# Altium schematic sheet proximity_kt.SchDoc
size A1
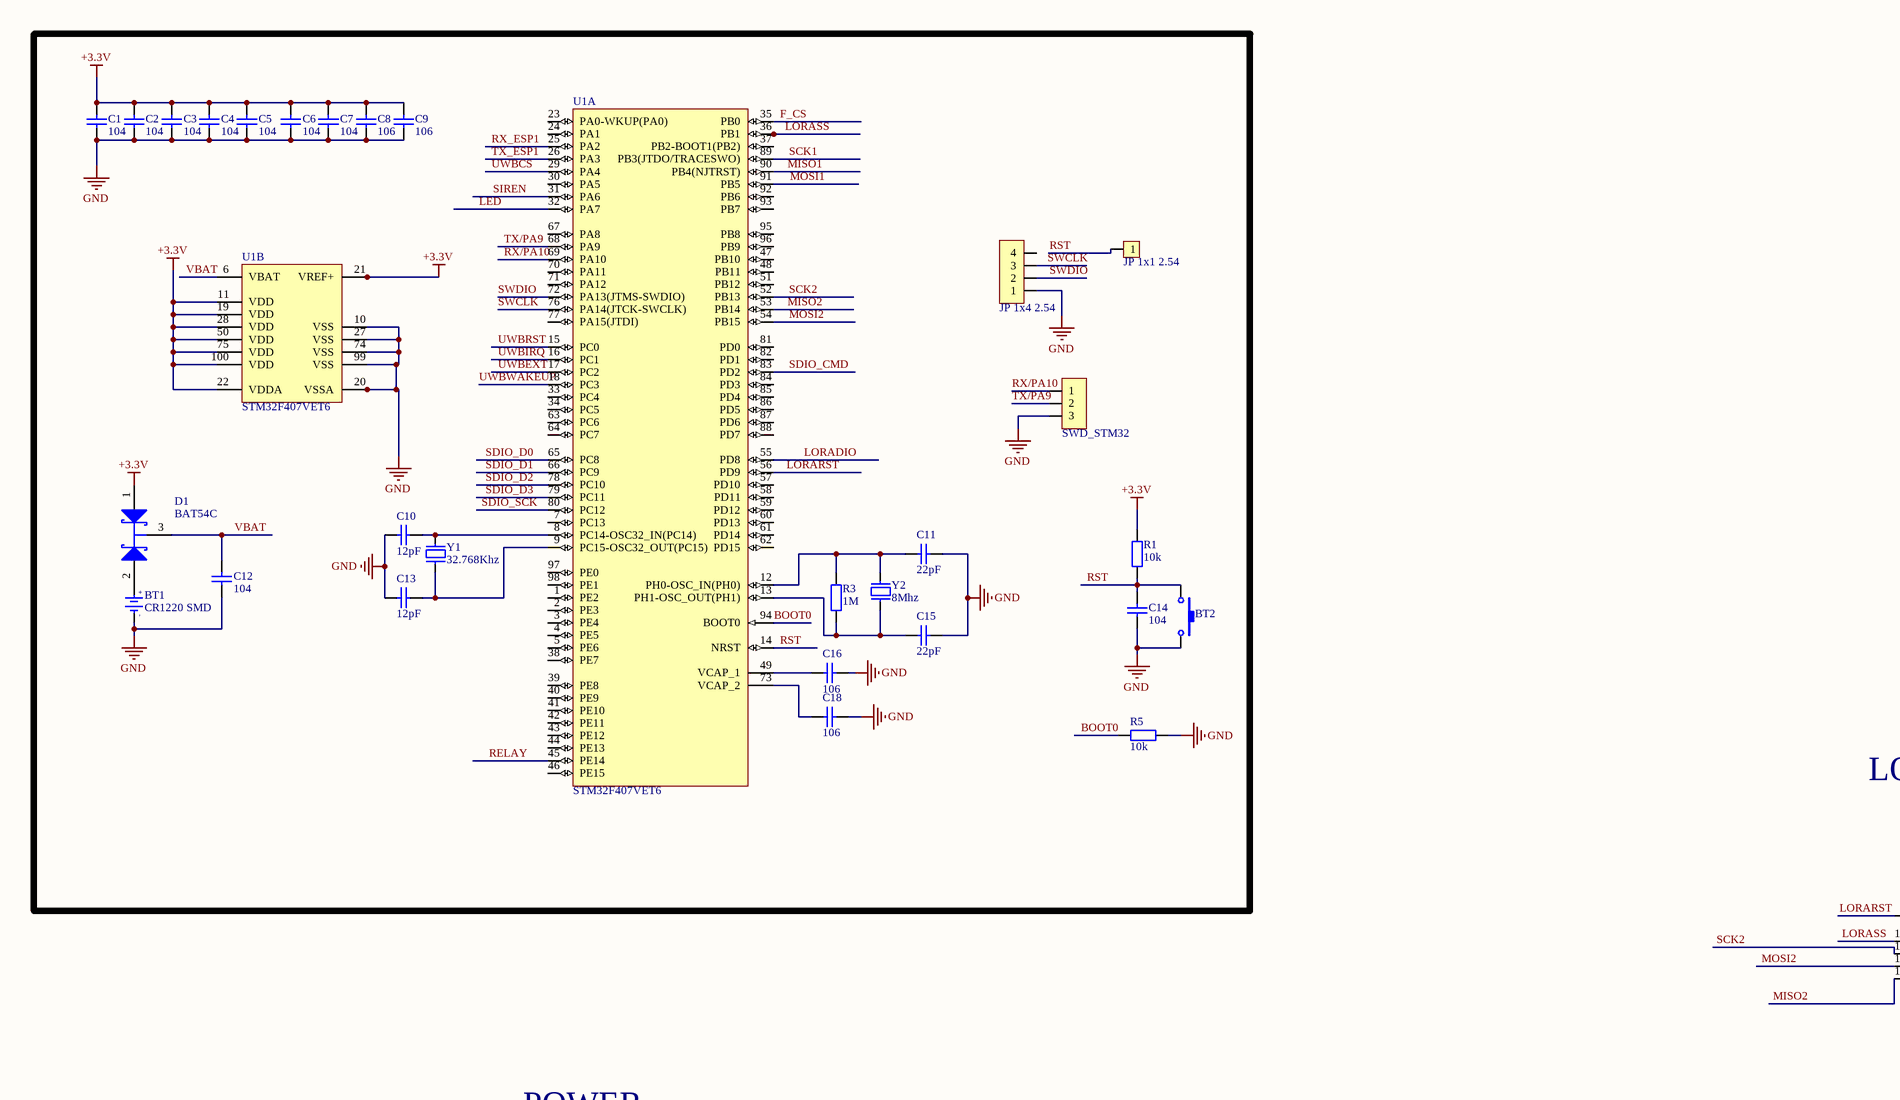
[diagram p0: proximity_kt.SchDoc, top left]
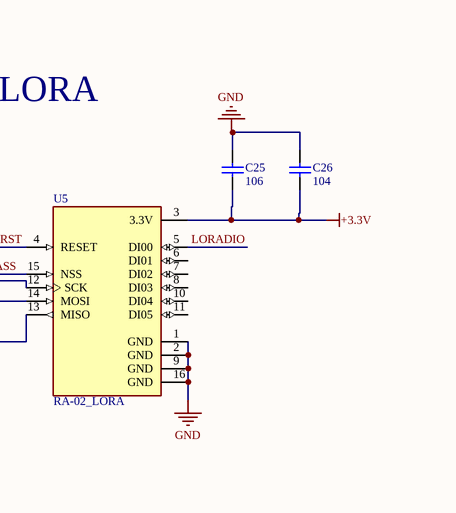
[diagram p1: proximity_kt.SchDoc, top right]
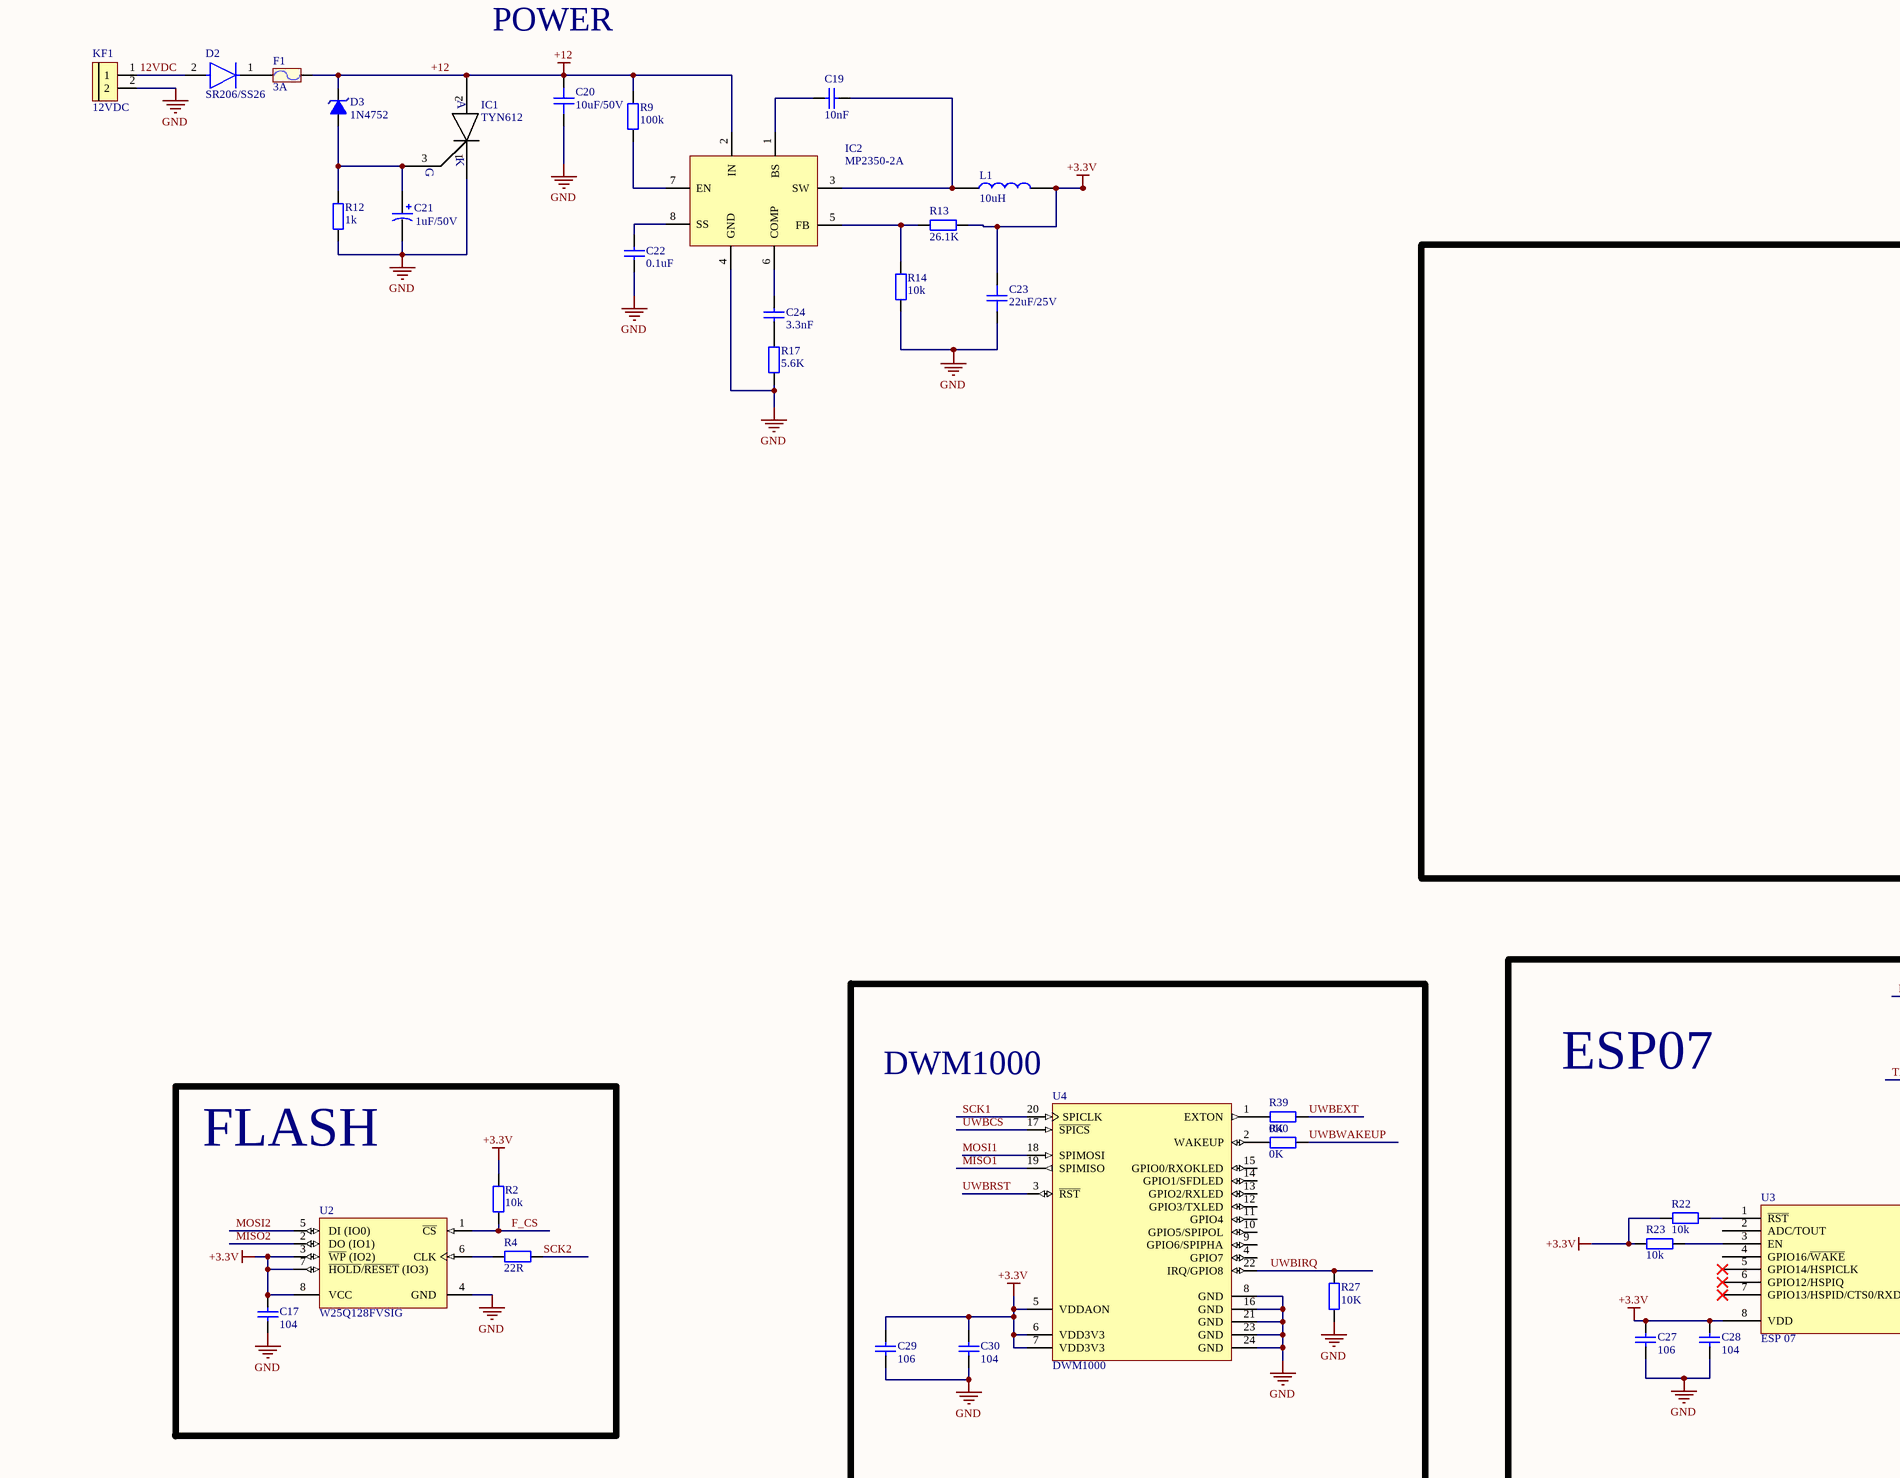
[diagram p2: proximity_kt.SchDoc, bottom left]
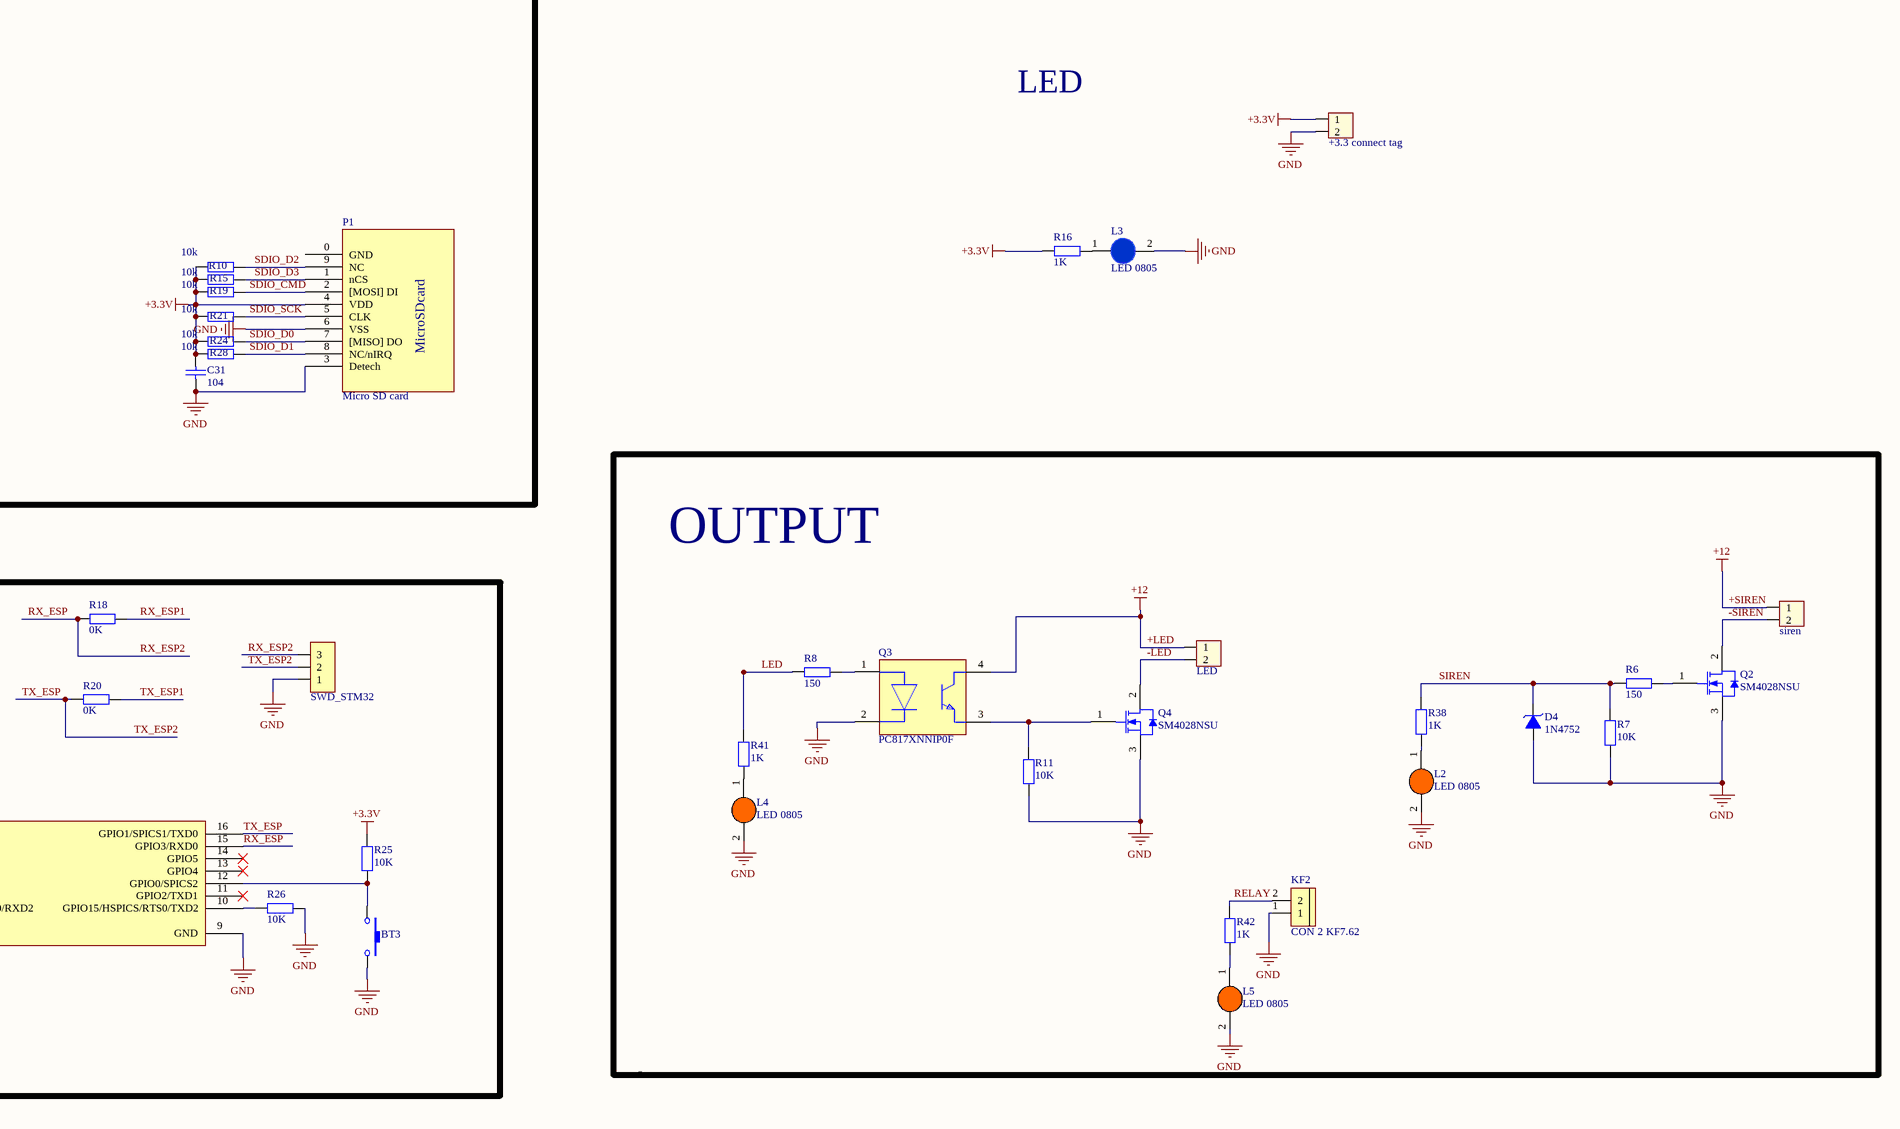
[diagram p3: proximity_kt.SchDoc, bottom right]

## Parts
BT1  CR1220 SMD  [DE PIN CR1220]
BT2  Nut Nhan 2 Chan SMD 3x6x2.5  [Nut Nhan 2 Chan SMD 3x6x2.5]  (value not drawn)
BT3  Nut Nhan 2 Chan SMD 3x6x2.5  [Nut Nhan 2 Chan SMD 3x6x2.5]  (value not drawn)
C1  104  [tu 0805]
C2  104  [tu 0805]
C3  104  [tu 0805]
C4  104  [tu 0805]
C5  104  [tu 0805]
C6  104  [tu 0805]
C7  104  [tu 0805]
C8  106  [tu 0805]
C9  106  [tu 0805]
C10  12pF  [tu 0805]
C11  22pF  [tu 0805]
C12  104  [tu 0805]
C13  12pF  [tu 0805]
C14  104  [tu 0805]
C15  22pF  [tu 0805]
C16  106  [tu 0805]
C17  104  [tu 0805]
C18  106  [tu 0805]
C19  10nF  [tu 0805]
C20  10uF/50V  [CAPC-1210 (3225)]
C21  1uF/50V  [CAP_ALUM_SMD_4054_TYPE_B]
C22  0.1uF  [tu 0805]
C23  22uF/25V  [CAPC-1210 (3225)]
C24  3.3nF  [tu 0805]
C25  106  [tu 0805]
C26  104  [tu 0805]
C27  106  [tu 0805]
C28  104  [tu 0805]
C29  106  [tu 0805]
C30  104  [tu 0805]
C31  104  [tu 0805]
D1  BAT54C  [NXP-SOT23-3_V]
D2  SR206/SS26  [FP-95401-MFG]
D3  1N4752  [DIODE ZENNER SMD SOD80]
D4  1N4752  [DIODE ZENNER SMD SOD80]
F1  3A  [Cau Chi SMD1808]
H2  siren  [XH2.54M-2]
H3  +3.3 connect tag  [XH2.54M-2]
H5  LED  [XH2.54M-2]
IC1  TYN612  [TYN612VER1]
IC2  MP2350-2A  [MP2305]
JP1  JP 1x4 2.54  [JP 1x4 DT]
JP2  SWD_STM32  [JP 1x3 DT]
JP3  SWD_STM32  [JP 1x3 DT]
JP5  JP 1x1 2.54  [JP 1x1 DT]
KF1  12VDC  [Con 2 KF301 5.08]
KF2  CON 2 KF7.62  [CON 2 KF7.62]
L1  10uH  [Cuon Cam 7x7x5]
L2  LED 0805  [LED-0805-Orange]
L3  LED 0805  [LED-0805-Blue]
L4  LED 0805  [LED-0805-Orange]
L5  LED 0805  [LED-0805-Orange]
P1  Micro SD card  [MicroSD]
Q2  SM4028NSU  [INF-PG-TO252-3-313_L]
Q3  PC817XNNIP0F  [FP-PC817XNNIP0F-MFG]
Q4  SM4028NSU  [INF-PG-TO252-3-313_L]
R1  10k  [tro smd 0805]
R2  10k  [tro smd 0805]
R3  1M  [tro smd 0805]
R4  22R  [tro smd 0805]
R5  10k  [tro smd 0805]
R6  150  [tro smd 0805]
R7  10K  [tro smd 0805]
R8  150  [tro smd 0805]
R9  100k  [tro smd 0805]
R10  10k  [tro smd 0805]
R11  10K  [tro smd 0805]
R12  1k  [tro smd 0805]
R13  26.1K  [tro smd 0805]
R14  10k  [tro smd 0805]
R15  10k  [tro smd 0805]
R16  1K  [tro smd 0805]
R17  5.6K  [tro smd 0805]
R18  0K  [tro smd 0805]
R19  10k  [tro smd 0805]
R20  0K  [tro smd 0805]
R21  10k  [tro smd 0805]
R22  10k  [tro smd 0805]
R23  10k  [tro smd 0805]
R24  10k  [tro smd 0805]
R25  10K  [tro smd 0805]
R26  10K  [tro smd 0805]
R27  10K  [tro smd 0805]
R28  10k  [tro smd 0805]
R38  1K  [tro smd 0805]
R39  0K  [tro smd 0805]
R40  0K  [tro smd 0805]
R41  1K  [tro smd 0805]
R42  1K  [tro smd 0805]
U1  STM32F407VET6  [STM-LQFP100_M]  (parts A,B of 2)
U2  W25Q128FVSIG  [WINB-SOIC-8_M]
U3  ESP 07  [ESP8266 07]
U4  DWM1000  [DECW-DWM1000-24_V]
U5  RA-02_LORA  [MODULE_RA-02_LORA]
Y1  32.768Khz  [Thach Anh 2 Chan 32,768 KHz]
Y2  8Mhz  [Thach Anh 2 chan SMD]

## Blocks framed on the sheet
OUTPUT: D4 H2 H5 KF2 L2 L4 L5 Q2-Q4 R6-R8 R11 R38 R41 R42
DWM1000: C29 C30 R27 R39 R40 U4
ESP07: BT3 C27 C28 JP2 R18 R20 R22 R23 R25 R26 U3
FLASH: C17 R2 R4 U2

## Nets
+3.3V: C1.1 C2.1 C3.1 C4.1 C5.1 C6.1 C7.1 C8.1 C9.1 C17.1 C23.2 C25.2 C26.2 C27.1 C28.1 C29.1 C30.1 C31.1 D1.1(A) H3.1 L1.2 P1.4(VDD) R1.2 R2.2 R10.2 R13.2 R15.2 R16.2 R19.2 R21.2 R22.2 R23.2 R24.2 R25.2 R28.2 U1.11(VDD) U1.19(VDD) U1.21(VREF+) U1.22(VDDA) U1.28(VDD) U1.50(VDD) U1.75(VDD) U1.100(VDD) U2.3(~{WP}_(IO2)) U2.7(~{HOLD}/~{RESET}_(IO3)) U2.8(VCC) U3.8(VDD) U4.5(VDDAON) U4.6(VDD3V3) U4.7(VDD3V3) U5.3(3.3V)
+12: C20.2 D3.2(K) F1.2 H2.1 H5.1 IC1.2(A) IC2.2(IN) Q3.4(C) R9.1  [also labelled +LED, +SIREN]
GND: BT1.2(GND) BT2.2 BT3.2 C1.2 C2.2 C3.2 C4.2 C5.2 C6.2 C7.2 C8.2 C9.2 C10.2 C11.1 C12.2 C13.2 C14.2 C15.1 C16.1 C17.2 C18.1 C20.1 C21.2 C22.2 C23.1 C25.1 C26.1 C27.2 C28.2 C29.2 C30.2 C31.2 D4.1(A) H3.2 IC1.1(K) IC2.4(GND) JP1.1 JP2.1 JP3.3 KF1.2 KF2.1 L2.2(K) L3.2(K) L4.2(K) L5.2(K) P1.3(Detech) P1.6(VSS) Q2.3(SOURCE) Q3.2(C) Q4.3(SOURCE) R5.1 R7.2 R11.2 R12.1 R14.2 R17.2 R26.2 R27.1 U1.10(VSS) U1.20(VSSA) U1.27(VSS) U1.74(VSS) U1.99(VSS) U2.4(GND) U3.9(GND) U4.8(GND) U4.16(GND) U4.21(GND) U4.23(GND) U4.24(GND) U5.1(GND) U5.2(GND) U5.9(GND) U5.16(GND)
12VDC: D2.2(A) KF1.1
-LED: H5.2 Q4.2(DRAIN)
-SIREN: H2.2 Q2.2(DRAIN)
BOOT0: R5.2 U1.94(BOOT0)
F_CS: R2.1 U1.35(PB0) U2.1(~{CS})
LED: R8.2 R41.2 U1.32(PA7)
LORADIO: U1.55(PD8) U5.5(DI00)
LORARST: U1.56(PD9) U5.4(RESET)
LORASS: U1.36(PB1) U5.15(NSS)
MISO1: U1.90(PB4(NJTRST)) U4.19(SPIMISO)
MISO2: U1.53(PB14) U2.2(DO_(IO1)) U5.13(MISO)
MOSI1: U1.91(PB5) U4.18(SPIMOSI)
MOSI2: U1.54(PB15) U2.5(DI_(IO0)) U5.14(MOSI)
RELAY: KF2.2 R42.2 U1.45(PE14)
RST: BT2.1 C14.1 JP5.1 R1.1 U1.14(NRST)
RX/PA10: JP3.1 U1.69(PA10)
RX_ESP: JP2.3 R18.1 U3.15(GPIO3/RXD0)  [also labelled RX_ESP2]
RX_ESP1: R18.2 U1.25(PA2)
SCK1: U1.89(PB3(JTDO/TRACESWO)) U4.20(SPICLK)
SCK2: R4.2 U1.52(PB13) U5.12(SCK)
SDIO_CMD: P1.2([MOSI]_DI) R19.1 U1.83(PD2)
SDIO_D0: P1.7([MISO]_DO) R24.1 U1.65(PC8)
SDIO_D1: P1.8(NC/nIRQ) R28.1 U1.66(PC9)
SDIO_D2: P1.9(NC) R10.1 U1.78(PC10)
SDIO_D3: P1.1(nCS) R15.1 U1.79(PC11)
SDIO_SCK: P1.5(CLK) R21.1 U1.80(PC12)
SIREN: D4.2(K) R6.2 R7.1 R38.2 U1.31(PA6)
SWCLK: JP1.3 U1.76(PA14(JTCK-SWCLK))
SWDIO: JP1.2 U1.72(PA13(JTMS-SWDIO))
TX/PA9: JP3.2 U1.68(PA9)
TX_ESP: JP2.2 R20.1 U3.16(GPIO1/SPICS1/TXD0)  [also labelled TX_ESP2]
TX_ESP1: R20.2 U1.26(PA3)
UWBCS: U1.29(PA4) U4.17(~{SPICS})
UWBEXT: R39.2 U1.17(PC2)
UWBIRQ: R27.2 U1.16(PC1) U4.22(IRQ/GPIO8)
UWBRST: U1.15(PC0) U4.3(~{RST})
UWBWAKEUP: R40.2 U1.18(PC3)
VBAT: C12.1 D1.3(K) U1.6(VBAT)
NetBT1_1: BT1.1(+3V) D1.2(A)
NetBT3_1: BT3.1 R25.1 U3.12(GPIO0/SPICS2)
NetC10_1: C10.1 U1.8(PC14-OSC32_IN(PC14)) Y1.2
NetC11_2: C11.2 R3.2 U1.12(PH0-OSC_IN(PH0)) Y2.2
NetC13_1: C13.1 U1.9(PC15-OSC32_OUT(PC15)) Y1.1
NetC15_2: C15.2 R3.1 U1.13(PH1-OSC_OUT(PH1)) Y2.1
NetC16_2: C16.2 U1.49(VCAP_1)
NetC18_2: C18.2 U1.73(VCAP_2)
NetC19_1: C19.1 IC2.1(BS)
NetC19_2: C19.2 IC2.3(SW) L1.1
NetC21_1: C21.1 D3.1(A) IC1.3(G) R12.2
NetC22_1: C22.1 IC2.8(SS)
NetC24_1: C24.1 IC2.6(COMP)
NetC24_2: C24.2 R17.1
NetD2_1: D2.1(C) F1.1
NetIC2_5: IC2.5(FB) R13.1 R14.1
NetIC2_7: IC2.7(EN) R9.2
NetL2_1: L2.1(A) R38.1
NetL3_1: L3.1(A) R16.1
NetL4_1: L4.1(A) R41.1
NetL5_1: L5.1(A) R42.1
NetQ2_1: Q2.1(GATE) R6.1
NetQ3_1: Q3.1(A) R8.1
NetQ3_3: Q3.3(E) Q4.1(GATE) R11.1
NetR4_1: R4.1 U2.6(CLK)
NetR22_1: R22.1 U3.1(~{RST})
NetR23_1: R23.1 U3.3(EN)
NetR26_1: R26.1 U3.10(GPIO15/HSPICS/RTS0/TXD2)
NetR39_1: R39.1 U4.1(EXTON)
NetR40_1: R40.1 U4.2(WAKEUP)

Not connected (* = marked no-connect by the designer): JP1 4; P1 0(GND); U1 1(PE2) 2(PE3) 3(PE4) 4(PE5) 5(PE6) 7(PC13) 23(PA0-WKUP(PA0)) 24(PA1) 30(PA5) 33(PC4) 34(PC5) 37(PB2-BOOT1(PB2)) 38(PE7) 39(PE8) 40(PE9) 41(PE10) 42(PE11) 43(PE12) 44(PE13) 46(PE15) 47(PB10) 48(PB11) 51(PB12) 57(PD10) 58(PD11) 59(PD12) 60(PD13) 61(PD14) 62(PD15) 63(PC6) 64(PC7) 67(PA8) 70(PA11) 71(PA12) 77(PA15(JTDI)) 81(PD0) 82(PD1) 84(PD3) 85(PD4) 86(PD5) 87(PD6) 88(PD7) 92(PB6) 93(PB7) 95(PB8) 96(PB9) 97(PE0) 98(PE1); U3 2(ADC/TOUT) 4(GPIO16/~{WAKE}) 5(GPIO14/HSPICLK)* 6(GPIO12/HSPIQ)* 7(GPIO13/HSPID/CTS0/RXD2)* 11(GPIO2/TXD1)* 13(GPIO4)* 14(GPIO5)*; U4 4(GPIO7) 9(GPIO6/SPIPHA) 10(GPIO5/SPIPOL) 11(GPIO4) 12(GPIO3/TXLED) 13(GPIO2/RXLED) 14(GPIO1/SFDLED) 15(GPIO0/RXOKLED); U5 6(DI01) 7(DI02) 8(DI03) 10(DI04) 11(DI05)

## Notes on the sheet
- LORA
- (near C20) POWER
- LED
- (in symbol De pin CR1220 SMD) +; -
- (in symbol Micro SD card) MicroSDcard

## Library data of the parts
BT1 = De pin CR1220 SMD: Ten: Đế PIN CR1220 SMD; Ma_Hang: MH000833; ComponentLink1Description: New link; ComponentLink1URL: https://www.thegioiic.com/de-pin-cr1220-dan-smd
BT2 BT3 = Nut Nhan 2 Chan SMD 3x6x2.5: Ma_Hang: MH001036; Ten: Nút Nhấn 2 Chân 3x6x2.5MM SMD
C1-C7 C12 C14 C17 C19 C22 C24 C26 C28 C30 C31 = Tu 0805 104 50V 10%: Dán; Don_Vi: Con; So_Chan: 2; Ten_Linh_Kien: Tụ 0805 104-100nF 10% 50V; Ma_Hang: MH004551; Chung_Loai: Dán; Kieu_Chan: *; ComponentLink1Description: New link
  C1-C7 C12 C14 C17 C26 C28 C30 C31: ComponentLink1URL: https://www.thegioiic.com/tu-gom-0805-100nf-0-1uf-50v
  C19: ComponentLink1URL: https://www.thegioiic.com/tu-gom-0805-10nf-50v; ComponentLink2Description: New link; ComponentLink2URL: 1900
  C22: ComponentLink1URL: https://www.thegioiic.com/tu-gom-0805-100pf-50v; ComponentLink2Description: New link; ComponentLink2URL: 1900
  C24: ComponentLink1URL: https://www.thegioiic.com/tu-gom-0805-3-3nf-50v; ComponentLink2Description: New link; ComponentLink2URL: 1900
C8 C9 C16 C18 C25 C27 C29 = Tu 0805 106 16V 10%: Dán; Ten_Linh_Kien: Tụ 0805 106-10uF 10% 16V; So_Chan: 2; Don_Vi: Con; Ma_Hang: MH004553; Chung_Loai: Dán; Kieu_Chan: *; ComponentLink1Description: New link; ComponentLink1URL: https://www.thegioiic.com/tu-gom-0805-10uf-25v
C10 C13 = Tu 0805 15pF 50V 10%: Dán; Don_Vi: Con; So_Chan: 2; Ten_Linh_Kien: Tụ 0805 15P 10% 50V; Ma_Hang: MH004556; Chung_Loai: Dán; Kieu_Chan: *; Parameter 1: https://www.thegioiic.com/tu-gom-0603-12pf-50v
C11 C15 = Tu 0805 22pF 50V 10%: Dán; Don_Vi: Con; So_Chan: 2; Ten_Linh_Kien: Tụ 0805 22P 10% 50V; Ma_Hang: MH004560; Chung_Loai: Dán; Kieu_Chan: *; ComponentLink1Description: New link; ComponentLink1URL: https://www.thegioiic.com/tu-gom-0805-22pf-50v
C20 C23 = CL32A227MQVNNNE: CAP CER 220uF 20% 6.3V X5R 1210; CompanyID: VT-01105; Value: 227/6.3V; Solder: SMT; MPN: CL32A227MQVNNNE; Category: CAPACITOR; PinCount: 2; ComponentLink1Description: New link; ComponentLink1URL: https://www.thegioiic.com/tu-gom-1210-10uf-50v; ComponentLink2Description: New link; ComponentLink2URL: 3400
C21 = EEE-HA1C100P: CAP ALUM 10uF 20% 16V SMD; MFR: Panasonic; Value: 10uF/16V; Solder: SMT; MPN: EEE-HA1C100P; Category: CAPACITOR; PinCount: 2; ComponentLink1Description: New link; ComponentLink1URL: https://www.thegioiic.com/tu-nhom-smd-1uf-50v-4x5-4mm
D1 = CMP-0417-00003-1: Schottky Barrier Diode, 30 V, 2 uA, -55 to 150 degC, 3-Pin SOT23, RoHS, Tape and Reel; Manufacturer: NXP Semiconductors; IR (uA): 2; VF (mV): 800; Trr (ns): 5; Cd (pF): 10; VR (V): 30; Rth(j-a) (K/W): 500; RoHS: TRUE; Packing: Tape and Reel; ComponentLink2URL: http://www.nxp.com/documents/data_sheet/BAT54_SER.pdf; PartNumber: BAT54C; ComponentLink2Description: Datasheet; Temperature Range: -55 to 150 degC; PackageReference: SOT23-3; PackageDescription: 3-Pin Plastic Surface-mounted Package, Body 1.3 x 2.9 mm, Pitch 0.95 mm; Mounting Technology: Surface Mount; ComponentLink1URL: http://www.nxp.com/; DatasheetVersion: Rev. 5; ComponentLink1Description: Manufacturer URL
D2 = CMP-02540-000056-1: DIODE GEN PURP 600V 2A DO214AA; Output Current: 1A; Element Configuration: Single; Max Forward Surge Current (Ifsm): 35A; Recovery Time: 75ns; Reverse Recovery Time-Max: 50ns; Forward Voltage: 1.25V; Max Reverse Current: 5uA; Polarity: Standard; Width: 3.94mm; Voltage Rating (DC): 600V; Case/Package: SMB; Packaging: Tape and Reel; Length: 4.57mm; Max Operating Temperature: 175°C; Package Quantity: 750; Lead Free: Lead Free; Max Reverse Voltage (DC): 600V; Mount: Surface Mount; Peak Non-Repetitive Surge Current: 35A; Max Repetitive Reverse Voltage (Vrrm): 600V; Reverse Voltage: 600V; Forward Current: 1A; Max Surge Current: 35A; Series: -; Radiation Hardening: No; Current Rating: 1A; Min Operating Temperature: -65°C; Reverse Recovery Time: 75ns; Number of Pins: 2; Average Rectified Current: 2A; Height: 2.24mm; ComponentLink1Description: New link; ComponentLink1URL: https://www.thegioiic.com/ss26-smb-diode-schottky-2a
D3 D4 = Diode Zener 15V: Dán; Don_Vi: Con; Ma_Hang: MH002883; Ten_Linh_Kien: Diode Zener 1/2W 15V SMD1206 ZMM15; Ghi_Chu: *; Chung_Loai: Dán; Kieu_Chan: *; ComponentLink1Description: New link; ComponentLink1URL: https://www.thegioiic.com/zmm24-diode-zener-24v-500mw-smd
F1 = Cau chi 0.5A 125V SMD1808: Ma_Hang: MH009241; Ten: Cầu Chì 0.5A 125V SMD1808 0451.500MRL; ComponentLink1Description: New link; ComponentLink1URL: https://www.thegioiic.com/cau-chi-tac-dong-nhanh-smd-1808-3a-250v
H2 H3 H5 = Header 2P 2.54 Duc Thang: Cắm; Ten_Linh_Kien: Header 2P XH2.54-2P Đực Thẳng; Don_Vi: Con; Ma_Hang: MH001283; Chung_Loai: Cắm
JP1 = JP 1x4 2.54 Duc Thang: Cắm; Ten_Linh_Kien: Jump Đơn Đực 2.54MM 1x40P Thẳng 11MM; Don_Vi: Con; Ma_Hang: MH000903; Ghi_Chu: *; Kieu_Chan: *; Chung_Loai: Cắm
JP2 JP3 = JP 1x3 2.54 Duc Thang: Cắm; Ten_Linh_Kien: Jump Đơn Đực 2.54MM 1x40P Thẳng 11MM; Don_Vi: Con; Ma_Hang: MH000903; Ghi_Chu: *; Kieu_Chan: *; Chung_Loai: Cắm; ComponentLink1Description: New link; ComponentLink1URL: https://www.thegioiic.com/hang-rao-duc-don-2-54mm-40-chan-1-hang-cao-11-2mm-xuyen-lo; ComponentLink2Description: New link; ComponentLink2URL: 900
JP5 = JP 1x1 2.54 Duc Thang: Cắm; Ten_Linh_Kien: Jump Đơn Đực 2.54MM 1x40P Thẳng 11MM; Don_Vi: Con; Ma_Hang: MH000903; Ghi_Chu: *; Kieu_Chan: *; Chung_Loai: Cắm
KF1 = CON 2 KF301: Cắm; Ma_Hang: MH000987; Ten_Linh_Kien: CON 2 KF301-2P 5.08MM Xanh Dương; Don_Vi: Con; Chung_Loai: Cắm; Ghi_Chu: *; Kieu_Chan: *
KF2 = CON 2 KF7.62: Cắm; Ma_Hang: MH002053; Ten_Linh_Kien: CON 2 KF7.62-2P 7.62MM (Đen Thẳng); Chung_Loai: Cắm; Ghi_Chu: *; Kieu_Chan: *; Don_Vi: Con; ComponentLink1Description: New link; ComponentLink1URL: https://www.thegioiic.com/kf7-62-2-terminal-khoi-han-pcb-2-cuc-20a-300v-7-62mm
L1 = CUON CAM 47uH SMD: Dán; Don_Vi: Con; Ma_Hang: MH004211; Ten_Linh_Kien: Cuộn Cảm 47uH 7x7x4MM CD74R; Ghi_Chu: *; Kieu_Chan: *; Chung_Loai: Dán; ComponentLink1Description: New link; ComponentLink1URL: https://www.thegioiic.com/cuon-cam-dan-smd-cd75-7855-100-10uh-2-3a; ComponentLink2Description: New link; ComponentLink2URL: 1300
L2 L4 L5 = LED 0805 Cam: Dán; Don_Vi: Con; Ma_Hang: MH002328; Ten_Linh_Kien: LED 0805 Màu Cam ( Orange); Ghi_Chu: *; Kieu_Chan: *; Chung_Loai: Dán; ComponentLink1Description: New link; ComponentLink1URL: https://www.thegioiic.com/led-cam-0805-dan-smd-trong-suot-harvatek; ComponentLink2Description: New link; ComponentLink2URL: 340
L3 = LED 0805 Xanh Duong: Dán; Don_Vi: Con; Ma_Hang: MH002327; Ten_Linh_Kien: LED 0805 Màu Xanh Dương (Blue); Ghi_Chu: *; Kieu_Chan: *; Chung_Loai: Dán; ComponentLink1Description: New link; ComponentLink1URL: https://www.thegioiic.com/led-xanh-duong-0805-dan-smd-trong-suot; ComponentLink2Description: New link; ComponentLink2URL: 190
Q2 Q4 = CMP-1164-00349-1: N-Channel CoolMOS E6 Power-Transistor, 600 V VDS, 7.3 A ID, -55 to 150 degC, PG-TO252-3-313, Reel, Green; Manufacturer: Infineon; PartNumber: IPD60R600C6; IDpuls (max): 19Â A; VDS (max): 600Â V; VGS(th) (min): 2.5Â V; Ptot (max): 63Â W; Rth: 2Â K/W; VGS(th) (max): 3.5Â V; QG: 20.5Â nC; Green: TRUE; RDS (on) (max): 600Â mOhm; ID (max): 7.3Â A; RthJA (max): 62Â K/W; Polarity: N; Packing: Reel; PackageVersion: Oct-10; ComponentLink3Description: Package Specification; ComponentLink3URL: http://www.infineon.com/dgdl/PG-TO252-3-313-Package_Overview.pdf?folderId=db3a30432b57a660012b81890ade72d2&fileId=db3a30432b57a660012b8193af2872eb; Mounting Technology: Surface Mount; Technology: CoolMOS C6; PackageDescription: 3-Pin Plastic (Green) Transistor Single Outline Package, 6.5 x 6.12 mm Body, 2.28 mm Pitch; ComponentLink2Description: Datasheet; RthJC (max): 2Â K/W; ComponentLink1Description: Manufacturer URL; ComponentLink1URL: http://www.infineon.com/; ComponentLink2URL: http://www.infineon.com/dgdl/IPD60R600C6_2_0.pdf?folderId=db3a30431ff98815012019af55de3f2c&fileId=db3a30432239cccd0122a83152b97d6f; PackageReference: PG-TO252-3-313; DatasheetVersion: Rev. 2.0
Q3 = CMP-65434-000005-1: OPTOISOLATOR 5KV TRANS 4SMD; Reverse Breakdown Voltage: 6V; Output Current per Channel: 30mA; Power Dissipation: 200mW; Collector-emitter Voltage-Max: 200mV; Max Output Voltage: 80V; Input Current: 50mA; Forward Voltage: 1.4V; Fall Time: 18000ns; Number of Elements: 1; Input Type: DC; Packaging: Tape and Reel; RoHS Compliant: Yes; Contact Plating: Copper; Min Operating Temperature: -30°C; Collector Emitter Saturation Voltage: 200mV; Max Input Current: 50mA; Radiation Hardening: No; Max Collector Current: 50mA; Case/Package: SMD/SMT; Mount: Surface Mount; Output Voltage: 80V; Forward Current: 50mA; Max Power Dissipation: 200mW; Collector Emitter Voltage (VCEO): 80V; Number of Channels: 1; Rise Time: 18000ns; Isolation Voltage: 5kV; Number of Pins: 4; Lead Free: Lead Free; Package Quantity: 2000; Isolation Voltage-Max: 5kV; Max Operating Temperature: 100°C; ComponentLink1Description: New link; ComponentLink1URL: https://www.thegioiic.com/pc817x2nip0f-optoisolator-transistor-output-5000vrms-1-channel-4-smd
R1 R2 R5 R9 R10 R13-R15 R17 R19 R21-R24 R28 = Tro 0805 5% 10k: Dán; Don_Vi: Con; So_Chan: 2; Ten_Linh_Kien: Trở 0805 5% 10k; Ma_Hang: MH005239; Chung_Loai: Dán; Kieu_Chan: *; ComponentLink1Description: New link; ComponentLink1URL: https://www.thegioiic.com/dien-tro-10-kohm-0805-1
R3 = Tro 0805 1% 1M: Dán; Don_Vi: Con; So_Chan: 2; Ten_Linh_Kien: Trở 0805 1% 1M; Ma_Hang: MH005469; Chung_Loai: Dán; Kieu_Chan: *; ComponentLink1Description: New link; ComponentLink1URL: https://www.thegioiic.com/dien-tro-1-mohm-0805-5
R4 = Tro 0805 1% 0.22R: Dán; Don_Vi: Con; So_Chan: 2; Ten_Linh_Kien: Trở 0805 1% 0.22R; Ma_Hang: MH005466; Chung_Loai: Dán; Kieu_Chan: *
R6-R8 R11 R16 R18 R20 R25-R27 R38-R42 = Tro 0603 5% 10k: Dán; Don_Vi: Con; So_Chan: 2; Ten_Linh_Kien: Trở 0603 5% 10k; Ma_Hang: MH006316; Chung_Loai: Dán; Kieu_Chan: *; ComponentLink1Description: New link; ComponentLink1URL: https://www.thegioiic.com/dien-tro-1-kohm-0603-1; ComponentLink2Description: New link; ComponentLink2URL: 2300
R12 = Tro 0805 1% 1k: Dán; Don_Vi: Con; So_Chan: 2; Ten_Linh_Kien: Trở 0805 1% 1k; Ma_Hang: MH005468; Chung_Loai: Dán; Kieu_Chan: *; ComponentLink1Description: New link; ComponentLink1URL: https://www.thegioiic.com/dien-tro-1-kohm-0805-1
U1 = CMP-0243-00016-3: ARM Cortex-M4 32-bit MCU+FPU, 210 DMIPS, 512 kB Flash, 192 kB Internal RAM, 82 I/Os, 100-pin LQFP, -40 to 85 degC, Tray; Manufacturer: STMicroelectronics; Supply Voltage(Vcc) max (V): 3.6; Supply Voltage(Vcc) min (V): 1.8; I/Os (High Current): 82; FLASH Size (Prog) (kB): 512; Operating Frequency(F) (Processor speed) (MHz): 168; D/A Converter: 2x12-bit; Internal RAM Size (kB): 192; PackageReference: LQFP100; Core: ARM Cortex-M4; ComponentLink1URL: http://www.st.com/web/en/home.html; ComponentLink1Description: Manufacturer URL; DatasheetVersion: Rev. 4; Packing: Tray; Mounting Technology: Surface Mount; ComponentLink2Description: Datasheet; ComponentLink2URL: http://www.st.com/st-web-ui/static/active/en/resource/technical/document/datasheet/DM00037051.pdf; ComponentLink3Description: Package Specification; PartNumber: STM32F407VET6; PackageVersion: Rev. 1, 06/2013; PackageDescription: 100-Pin Low Profile Quad Flat Package, 14 x 14 mm Body, 0.5 mm Pitch; ComponentLink3URL: http://www.st.com/st-web-ui/static/active/en/resource/technical/document/data_brief/DM00071938.pdf
U2 = CMP-2000-05005-1: 3V 128M-Bit Serial Flash Memory with Dual/Quad SPI & QPI, 2.7 to 3.6 V, -40 to 85 degC, 8-Pin SOIC, RoHS, Tape and Reel; Manufacturer: Winbond; Number of Words: 16777216; Address Bus: 24b; Word Size: 8b; Boot Type: NotRequired; Supply Current: 20mA; Operating Supply Voltage (Max): 3.6V; Sync/Async: Synchronous; Rad Hardened: No; Interface Type: Serial(SPI); Access Time (Max): 7ns; Operating Supply Voltage (Min): 2.7V; Operating Supply Voltage (Typ): 3/3.3V; Programmable: Yes; Density: 134217728Bit; Cell Type: NOR; Package Description: 8-Pin Small Outline Integrated Circuit, Body 5.28 x 5.28 mm, Pitch 1.27 mm; Datasheet URL: http://download.siliconexpert.com/pdfs/2015/11/30/6/42/17/890/win_/manual/3w25q128fv20rev.l2008242015.pdf; Package Reference: SS-8; Package Type: SOICW; Datasheet Version: Rev. L, 08/2015; Manufacturer URL: http://www.winbond.com/hq/index.html?__locale=en; Pin Count: 8; Operating Temperature Classification: Industrial; Operating Temperature (Min): -40C; Program/Erase Volt (Typ): 2.7to3.6V; Operating Temperature (Max): 85C; Mounting: SurfaceMount; Operating Temp Range: -40Cto85C
U3 = ESP8266 07: ESP8266 07 16 Pin; IC: ESP8266-EX; Vendor: Ai-thinker
U4 = CMP-2000-05094-1: DW M1000 IEEE 802.15.4 -2011 UWB Transceiver Module; Manufacturer: Decawave; Voltage - Supply: 2.8V~3.6V; Protocol: IR-UWB; Featured Product: ScenSorDWM1000Module; Design Resources: DevelopmentToolSelector; Frequency: 3.5GHz~6.5GHz; Antenna Type: Integrated,Chip; Other Names: 1479-1002-2RUPF-G001A; Current - Receiving: 64mA; Data Rate: 6.8Mbps; Serial Interfaces: SPI; Current - Transmitting: 31mA; Modulation: BPM,BPSK; Standard Package: 500; Series: -; RF Family/Standard: 802.15.4; Operating Temperature: -40degC~85degC; Sensitivity: -; Packaging: Tape&Reel(TR); Datasheet Version: Rev. V1.0, 12/2015; Power - Output: -; Family: RFTransceiverModules; Memory Size: -; Package / Case: Module; Mounting Type: SurfaceMount; Datasheet URL: http://www.decawave.com/sites/default/files/resources/dwm1000-datasheet-v1.3.pdf; Online Catalog: ScenSorDWM1000Module; Category: RF/IFandRFID; Manufacturer URL: http://www.decawave.com/; ComponentLink1Description: New link; ComponentLink1URL: https://www.mouser.vn/ProductDetail/Qorvo/DWM1000?qs=sGAEpiMZZMu3sxpa5v1qrrjDD2pjKdCcRPXEFIZh8rA%3D; ComponentLink2Description: New link; ComponentLink2URL: 16.67$
U5 = RA-02_LORA: Ra-02 LoRa RF M5Stack Platform Evaluation Expansion Board; MF: AI-Thinker; Package: None; Check_prices: https://www.snapeda.com/parts/Ra-02%20LoRa/AI-Thinker/view-part/?ref=eda; Value: *; MP: Ra-02 LoRa; Availability: Not in stock; SnapEDA_Link: https://www.snapeda.com/parts/Ra-02%20LoRa/AI-Thinker/view-part/?ref=snap; Price: None
Y1 = Thach Anh 2 chan 32,768 Khz: Crystal For all Crystal 2pin.; Value: 4Mhz; ComponentLink1Description: New link; ComponentLink1URL: https://www.thegioiic.com/thach-anh-32-768khz-2x6mm
Y2 = Thach Anh 2 chan SMD: Crystal For all Crystal 2pin.; Value: 4Mhz